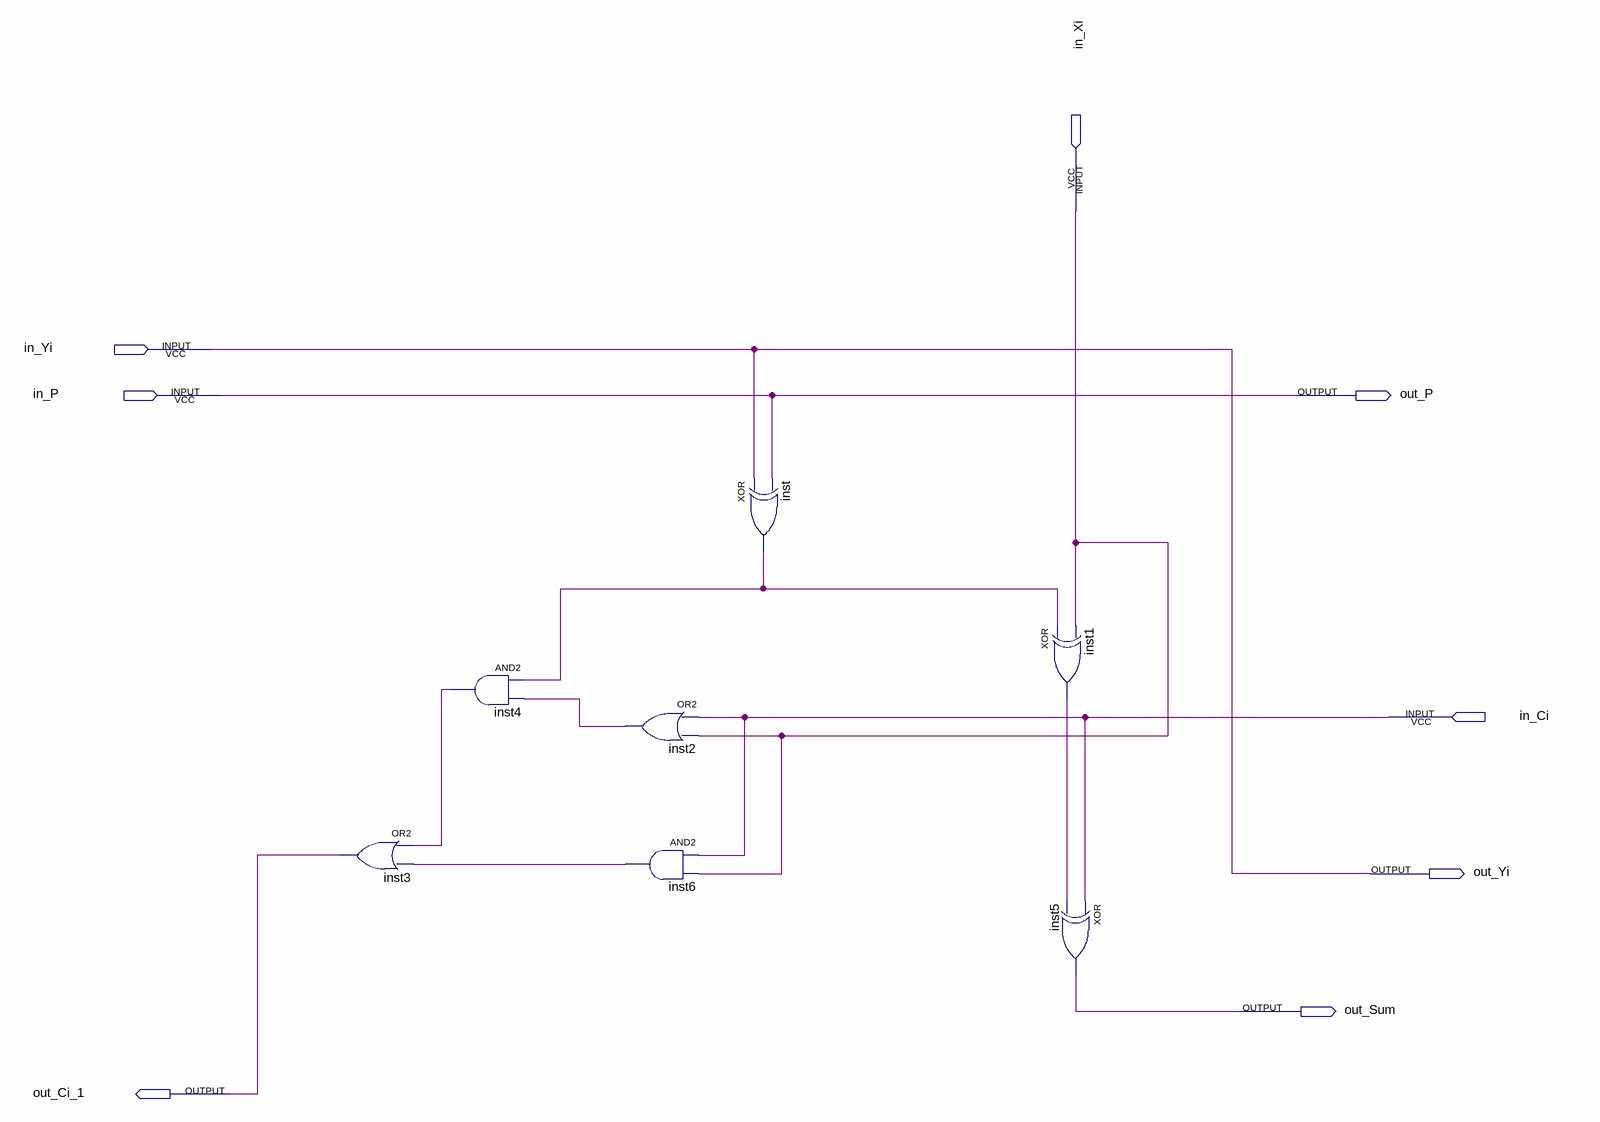
[diagram p0: schematic sheet]
// Quartus schematic CAS.bdf as structural Verilog: 7 symbols, 8 pins
module CAS (
  input  in_Xi,
  input  in_Yi,
  input  in_P,
  input  in_Ci,
  output out_P,
  output out_Yi,
  output out_Sum,
  output out_Ci_1
);

  wire inst1_out, inst2_out, inst4_out, inst6_out, inst_out;

  or inst3 (out_Ci_1, inst4_out, inst6_out);
  and inst4 (inst4_out, inst_out, inst2_out);
  or inst2 (inst2_out, in_Ci, in_Xi);
  and inst6 (inst6_out, in_Ci, in_Xi);
  xor inst (inst_out, in_Yi, in_P);
  xor inst1 (inst1_out, inst_out, in_Xi);
  xor inst5 (out_Sum, in_Ci, inst1_out);

  assign out_P = in_P;
  assign out_Yi = in_Yi;
endmodule
